# EAGLE schematic breakout (EAGLE 7.5.0)
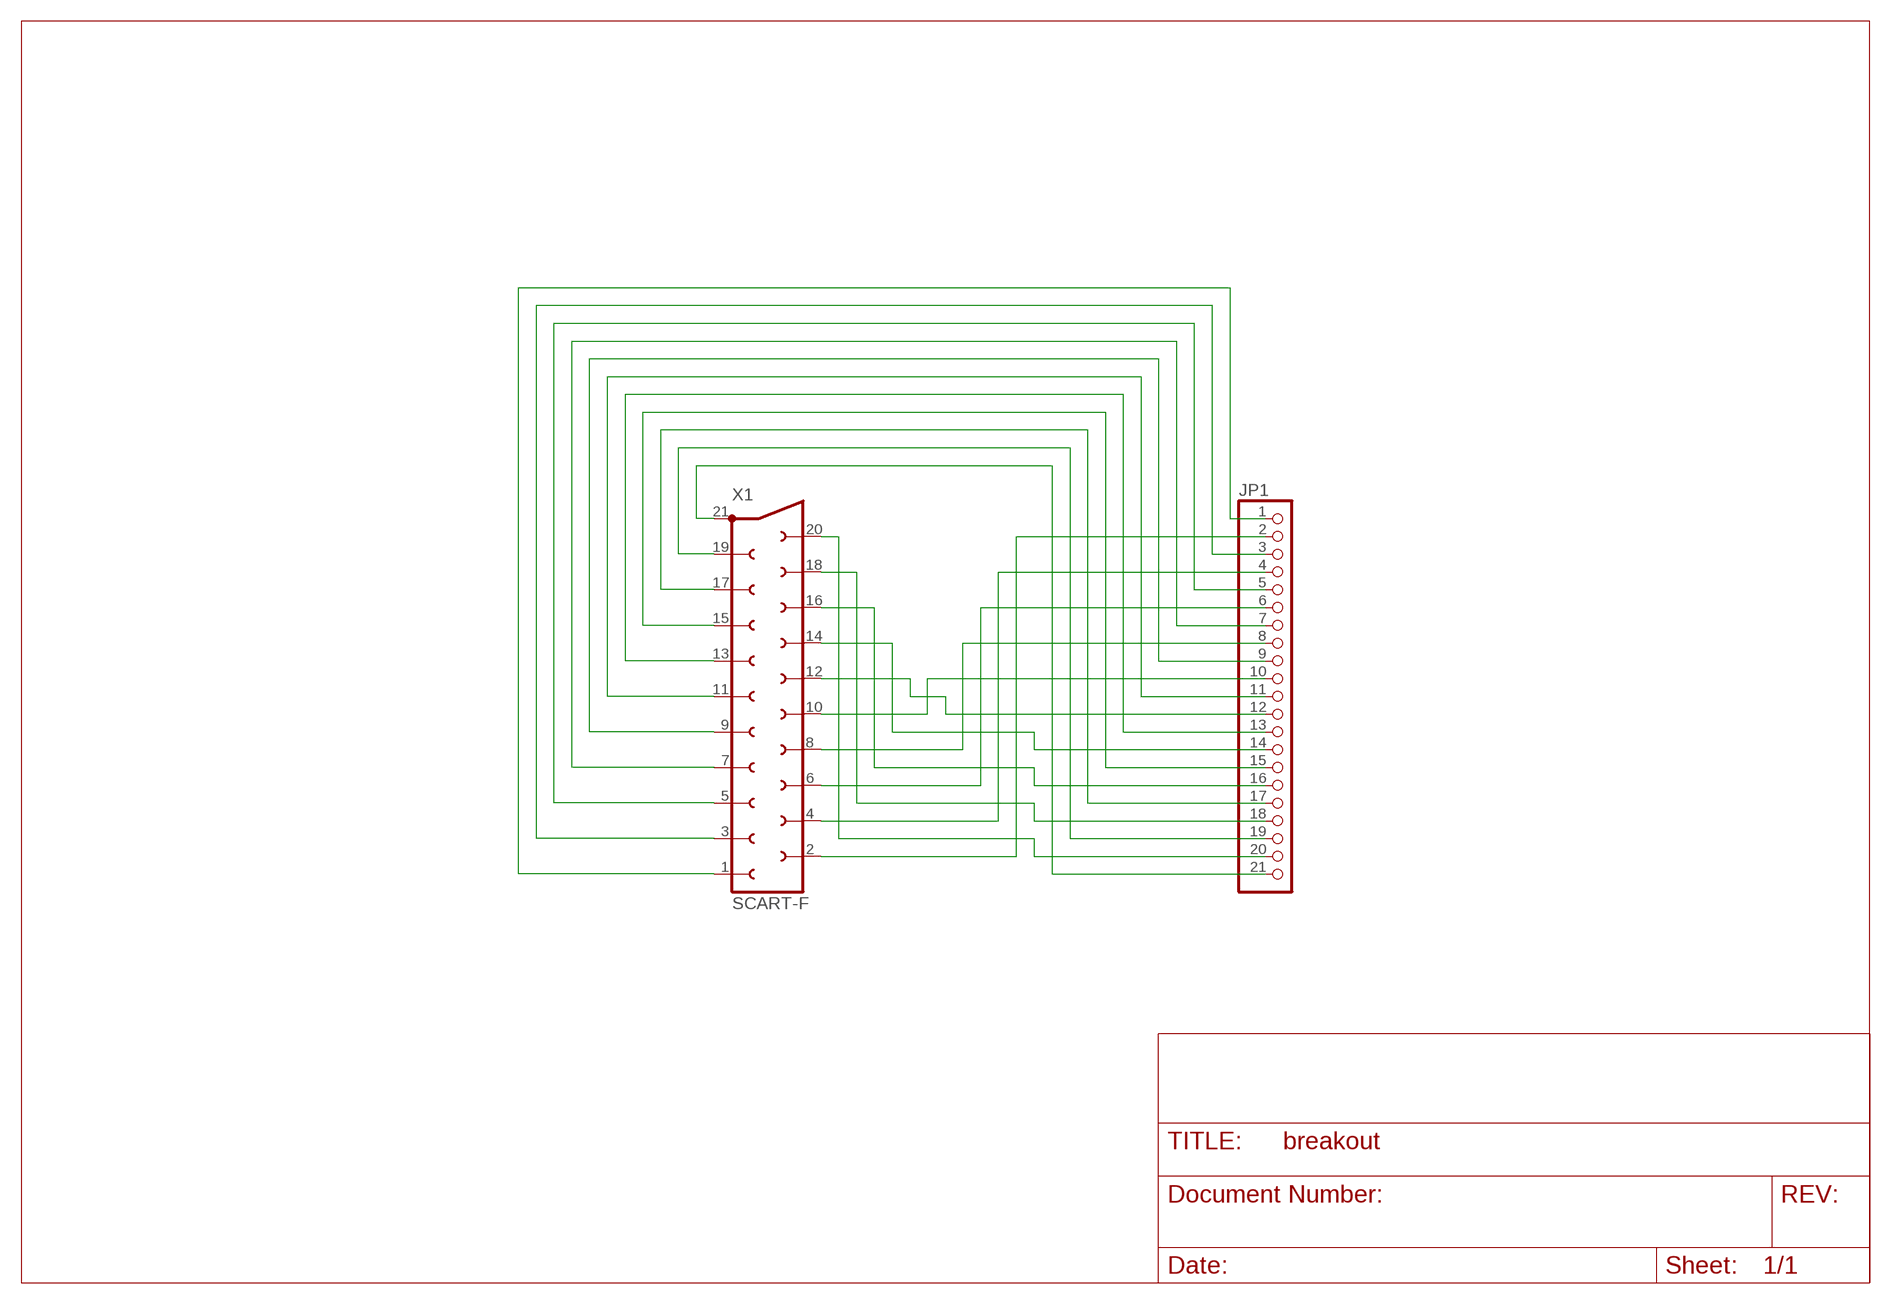
[diagram p0: schematic, sheet 1]

## Parts
JP1  PINHD-1X21  [1X21]
X1  SCART-F  [SCART-F]

## Nets
N$1: JP1.10 X1.10
N$2: JP1.12 X1.12
N$3: JP1.8 X1.8
N$4: JP1.6 X1.6
N$5: JP1.4 X1.4
N$6: JP1.2 X1.2
N$7: JP1.14 X1.14
N$8: JP1.16 X1.16
N$9: JP1.18 X1.18
N$10: JP1.20 X1.20
N$11: JP1.21 X1.21
N$12: JP1.19 X1.19
N$13: JP1.17 X1.17
N$14: JP1.15 X1.15
N$15: JP1.13 X1.13
N$16: JP1.11 X1.11
N$17: JP1.9 X1.9
N$18: JP1.7 X1.7
N$19: JP1.5 X1.5
N$20: JP1.3 X1.3
N$21: JP1.1 X1.1

## Library data of the parts
JP1 = pinhead:PINHD-1X21: PIN HEADER
X1 = con-hirschmann:SCART-F: TV SCART CONNECTOR; OC_FARNELL: unknown; OC_NEWARK: unknown